# Altium project GNSS_FE.PrjPcb
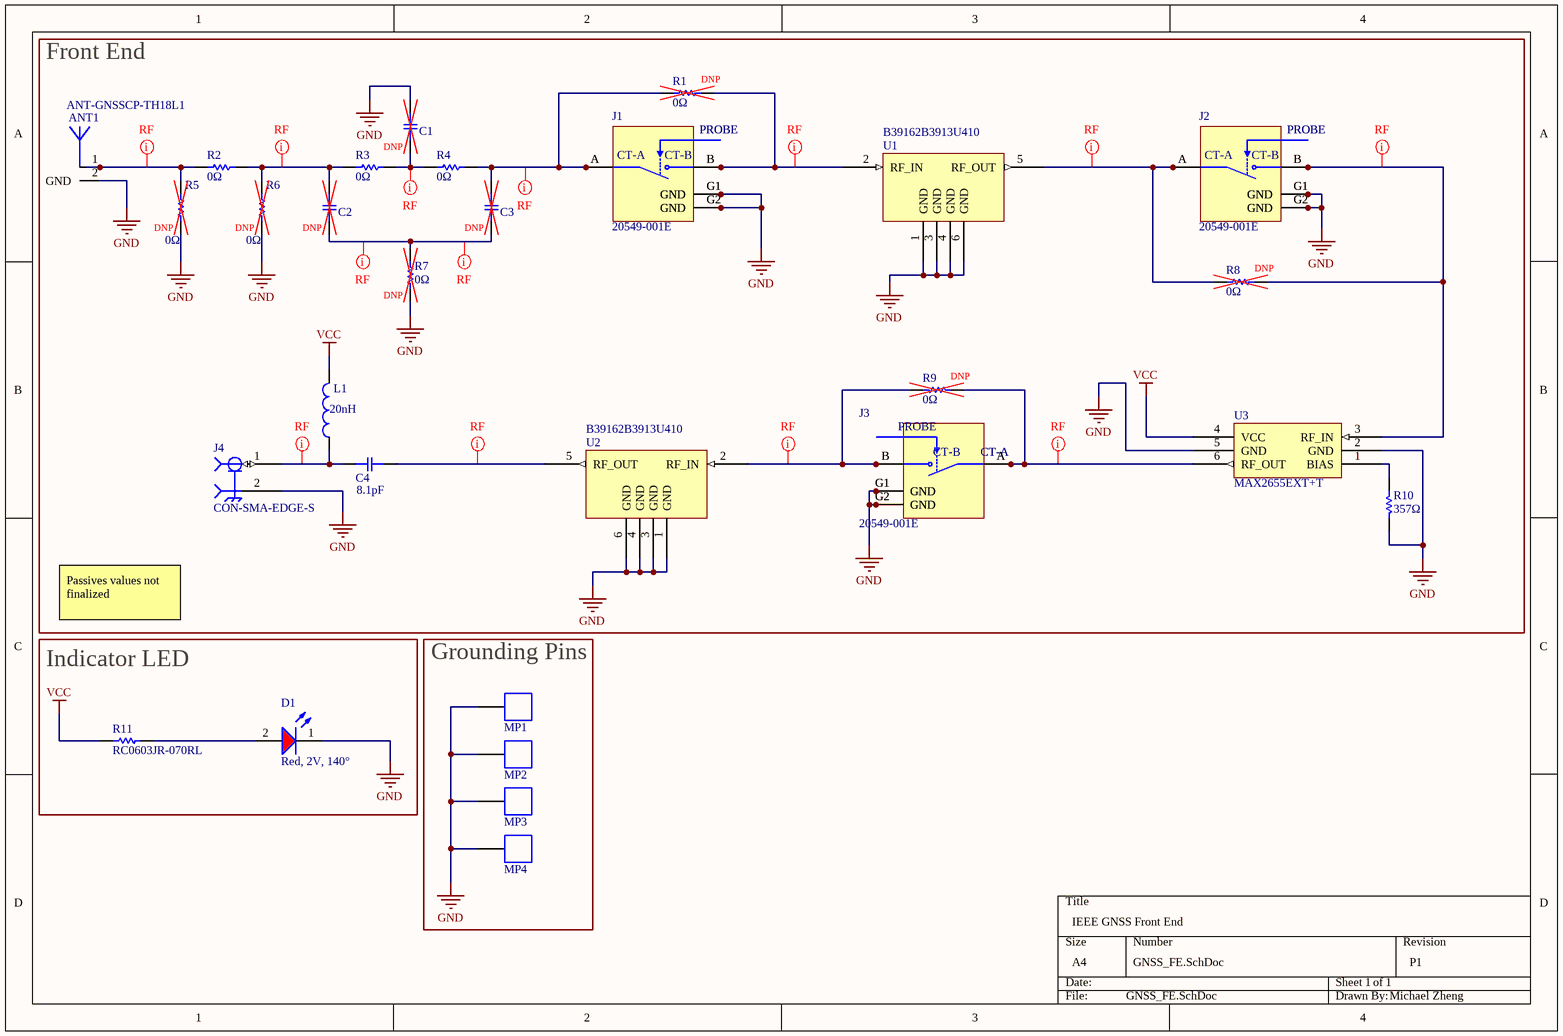
[diagram p0: GNSS_FE.SchDoc]
Author: Michael Zheng; Revision: P1; Title: IEEE GNSS Front End
1 sheet, 29 parts. Net scope: global (net labels, ports and power ports of the same name join across sheets).

## Sheet GNSS_FE.SchDoc: IEEE GNSS Front End
size A4; SheetNumber: 1; SheetTotal: 1

### Parts
ANT1  ANT-GNSSCP-TH18L1  [ANT-GNSSCP-TH18L1]
C1  GRM188R61A105KA61D  [CAP_MURATA_0603]  (value not drawn)
C2  GRM188R61A105KA61D  [CAP_MURATA_0603]  (value not drawn)
C3  GRM188R61A105KA61D  [CAP_MURATA_0603]  (value not drawn)
C4  Capacitance: 8.1pF  [CAP_MURATA_0603]  (hidden comment: GRM188R61A105KA61D)
D1  Red, 2V, 140°  [WL-SMCW]
J1  20549-001E  [IPEX_20549-001E]
J2  20549-001E  [IPEX_20549-001E]
J3  20549-001E  [IPEX_20549-001E]
J4  CON-SMA-EDGE-S  [RFSOLUTIONS_CON-SMA-EDGE-S]
L1  value 20nH  [INDC1006X60N]  (hidden comment: LQW15AN3N6C10D)
MP1  36900000  [36900000]  (value not drawn)
MP2  36900000  [36900000]  (value not drawn)
MP3  36900000  [36900000]  (value not drawn)
MP4  36900000  [36900000]  (value not drawn)
R1  Resistance: 0Ω  [RC0603JR-070RL]  (hidden comment: RC0603JR-070RL)
R2  Resistance: 0Ω  [RC0603JR-070RL]  (hidden comment: RC0603JR-070RL)
R3  Resistance: 0Ω  [RC0603JR-070RL]  (hidden comment: RC0603JR-070RL)
R4  Resistance: 0Ω  [RC0603JR-070RL]  (hidden comment: RC0603JR-070RL)
R5  Resistance: 0Ω  [RC0603JR-070RL]  (hidden comment: RC0603JR-070RL)
R6  Resistance: 0Ω  [RC0603JR-070RL]  (hidden comment: RC0603JR-070RL)
R7  Resistance: 0Ω  [RC0603JR-070RL]  (hidden comment: RC0603JR-070RL)
R8  Resistance: 0Ω  [RC0603JR-070RL]  (hidden comment: RC0603JR-070RL)
R9  Resistance: 0Ω  [RC0603JR-070RL]  (hidden comment: RC0603JR-070RL)
R10  Resistance: 357Ω  [RC0603JR-070RL]
R11  RC0603JR-070RL  [RC0603JR-070RL]
U1  B39162B3913U410  [B39162B3913U410]
U2  B39162B3913U410  [B39162B3913U410]
U3  MAX2655EXT+T  [MAX2655EXT+T]

### Blocks framed on the sheet
Front End: ANT1 C1-C4 J1-J4 L1 R1-R10 U1-U3
Indicator LED: D1 R11
Grounding Pins: MP1-MP4

### Nets
GND: ANT1.2(GND) C1.2 D1.1(K) J1.G1(GND) J1.G2(GND) J2.G1(GND) J2.G2(GND) J3.G1(GND) J3.G2(GND) J4.2(GND) MP1.1 MP2.1 MP3.1 MP4.1 R5.1 R6.1 R7.2 R10.2 U1.1(GND) U1.3(GND) U1.4(GND) U1.6(GND) U2.1(GND) U2.3(GND) U2.4(GND) U2.6(GND) U3.2(GND) U3.5(GND)
VCC: L1.2 R11.1 U3.4(VCC)
NetANT1_1: ANT1.1(RF_IN) R2.2 R5.2
NetC1_1: C1.1 R3.1 R4.2
NetC2_1: C2.1 C3.1 R7.1
NetC2_2: C2.2 R2.1 R3.2 R6.2
NetC3_2: C3.2 J1.A(CT-A) R1.2 R4.1
NetC4_1: C4.1 U2.5(RF_OUT)
NetC4_2: C4.2 J4.1(RF) L1.1
NetD1_2: D1.2(A) R11.2
NetJ1_B: J1.B(CT-B) R1.1 U1.2(RF_IN)
NetJ2_A: J2.A(CT-A) R8.2 U1.5(RF_OUT)
NetJ2_B: J2.B(CT-B) R8.1 U3.3(RF_IN)
NetJ3_A: J3.A(CT-A) R9.2 U3.6(RF_OUT)
NetJ3_B: J3.B(CT-B) R9.1 U2.2(RF_IN)
NetR10_1: R10.1 U3.1(BIAS)

### Layout directives
net class RF: NetANT1_1, NetC1_1, NetC2_1, NetC2_2, NetC3_2, NetC4_1, NetC4_2, NetJ1_B, NetJ2_A, NetJ2_B, NetJ3_A, NetJ3_B

### Notes on the sheet
- (near R1) DNP
- DNP
- (near R5) DNP
- (near R6) DNP
- (near C2) DNP
- (near C3) DNP
- (near R7) DNP
- (near R8) DNP
- (near R9) DNP
- Passives values not finalized
- (in symbol 20549-001E) PROBE

### Library data of the parts
ANT1 = ANT-GNSSCP-TH18L1: CERAMIC PATCH GNSS ANTENNA
C1-C4 = GRM188R61A105KA61D: CAP CER 1UF 10V X5R 0603
  C1-C3: Capacitance: 1uF
D1 = 150060RS75000: WL-SMCW Mono-color Chip LED Waterclear, SMT, size 0603, Red, 2V, 140°; Manufacturer: Wurth Elektronik; Case/Size Code: 0603; Chip Technology: AlInGaP; Dominant Wavelength: 625nm; Luminous Intensity: 250mcd; Peak Wavelength: 630nm; Manufacturer Part Number: 150060RS75000; Category: Signal LEDs; Match Code: WL-SMCW; ComponentLink1Description: Website Link; ComponentLink1URL: https://www.we-online.com/redexpert/article/150060RS75000?ad; ComponentLink2Description: Datasheet Link; ComponentLink2URL: https://www.we-online.com/redexpert/spec/150060RS75000?ad; Mount: Surface Mount; Operating Temperature Max: 85°C; Operating Temperature Min: -40°C; Packaging: Tape and Reel; Length: 1.6mm; Width: 0.8mm; Height: 0.7mm; Emitting Color: Red; Forward Voltage: 2V; Viewing Angle: 140°
J1-J3 = 20549-001E: 1 POS Vertical SMD Coaxial RF switch connector with a 2.3 x 2.3 mm footprint and support to 11 GHz, MHC; MF: I-PEX; Package: None; Value: *; MP: 20549-001E; Availability: Warning; Price: None; SnapEDA_Link: https://www.snapeda.com/parts/20549-001E/I-PEX/view-part/3220455/?ref=snap; Check_prices: https://www.snapeda.com/parts/20549-001E/I-PEX/view-part/3220455/?ref=eda
J4 = CON-SMA-EDGE-S: CONN SMA JACK STR EDGE MNT
L1 = LQW15AN3N6C10D: FIXED IND 3.6NH 900MA 40 MOHM; Package: None; Price: None; MP: LQW15AN3N6C10D; Availability: Unavailable
MP1-MP4 = 36900000: WE-SHC Shielding Cabinet, Clip, Tin Plated, Tape and Reel, 6.5x0.8x1.27mm; Manufacturer: Wurth Elektronik; Base Material: Steel; ComponentLink1Description: Website Link; ComponentLink1URL: https://www.we-online.com/redexpert/article/36900000?ad; ComponentLink2Description: Datasheet Link; ComponentLink2URL: https://www.we-online.com/redexpert/spec/36900000?ad; Manufacturer Part Number: 36900000; Category: EMC Shielding; Match Code: WE-SHC; Mount: Surface Mount; Operating Temperature Max: 125°C; Operating Temperature Min: -40°C; Packaging: Tape and Reel; Length: 6.5mm; Width: 0.8mm; Height: 1.27mm; Plating: Tin Plated; Type: Clip
R1-R10 = RC0603JR-070RL: Chip Resistor, 0 Ohm, +/- 5%, 0.1 W, -55 to 155 degC, 0603 (1608 Metric), RoHS, Tape and Reel; Manufacturer: Yageo; Temperature Coefficient: 200ppm/degreesC; Voltage Rating: 50V; Power Rating: 100mW; Width: 0.8mm; Max Operating Temperature: 155degC; Tolerance: 5%; Package Reference: 0603; Height: 0.45mm; Depth: 0.8mm; Package Description: 2-Pin Surface Mount Device, Body 1.6 x 0.8 mm; Termination: SMD/SMT; Package Quantity: 5000; Case/Package: 0603; Case Code (Imperial): 0603; Radiation Hardening: No; Number of Pins: 2; Length: 1.6mm; Lead Free: LeadFree; Voltage Rating (DC): 50V; Military Standard: Not; Datasheet URL: http://www.yageo.com/NewPortal/yageodocoutput?fileName=/pdf/R-Chip/PYu-RC_Group_51_RoHS_L_5.pdf; Manufacturer URL: http://www.yageo.com/; Packaging: TapeandReel; Case Code (Metric): 1608; Min Operating Temperature: -55degC; Composition: ThickFilm; RoHSCompliant: true; Contact Plating: Tin; Datasheet Version: Rev. 5, 10/2016; REACH SVHC: NoSVHC
R11 = RC0603JR-070RL: Chip Resistor, 0 Ohm, +/- 5%, 0.1 W, -55 to 155 degC, 0603 (1608 Metric), RoHS, Tape and Reel; Manufacturer: Yageo; Temperature Coefficient: 200ppm/degreesC; Voltage Rating: 50V; Power Rating: 100mW; Resistance: 0mOhm; Width: 0.8mm; Max Operating Temperature: 155degC; Tolerance: 5%; Package Reference: 0603; Height: 0.45mm; Depth: 0.8mm; Package Description: 2-Pin Surface Mount Device, Body 1.6 x 0.8 mm; Termination: SMD/SMT; Package Quantity: 5000; Case/Package: 0603; Case Code (Imperial): 0603; Radiation Hardening: No; Number of Pins: 2; Length: 1.6mm; Lead Free: LeadFree; Voltage Rating (DC): 50V; Military Standard: Not; Datasheet URL: http://www.yageo.com/NewPortal/yageodocoutput?fileName=/pdf/R-Chip/PYu-RC_Group_51_RoHS_L_5.pdf; Manufacturer URL: http://www.yageo.com/; Packaging: TapeandReel; Case Code (Metric): 1608; Min Operating Temperature: -55degC; Composition: ThickFilm; RoHSCompliant: true; Contact Plating: Tin; Datasheet Version: Rev. 5, 10/2016; REACH SVHC: NoSVHC
U1 U2 = B39162B3913U410: FILTER SAW 1.588GHZ 6SMD
U3 = MAX2655EXT+T: IC AMP GPS 1.4GHZ-1.7GHZ SC70-6

## Assembly variants
Variant of GNSS_FE: not fitted C1 C2 C3 R1 R5 R6 R7 R8 R9 R10